# Altium project V3.PrjPcb (part 2 of 4)

## Sheet ETH_Switch.SchDoc
size A3
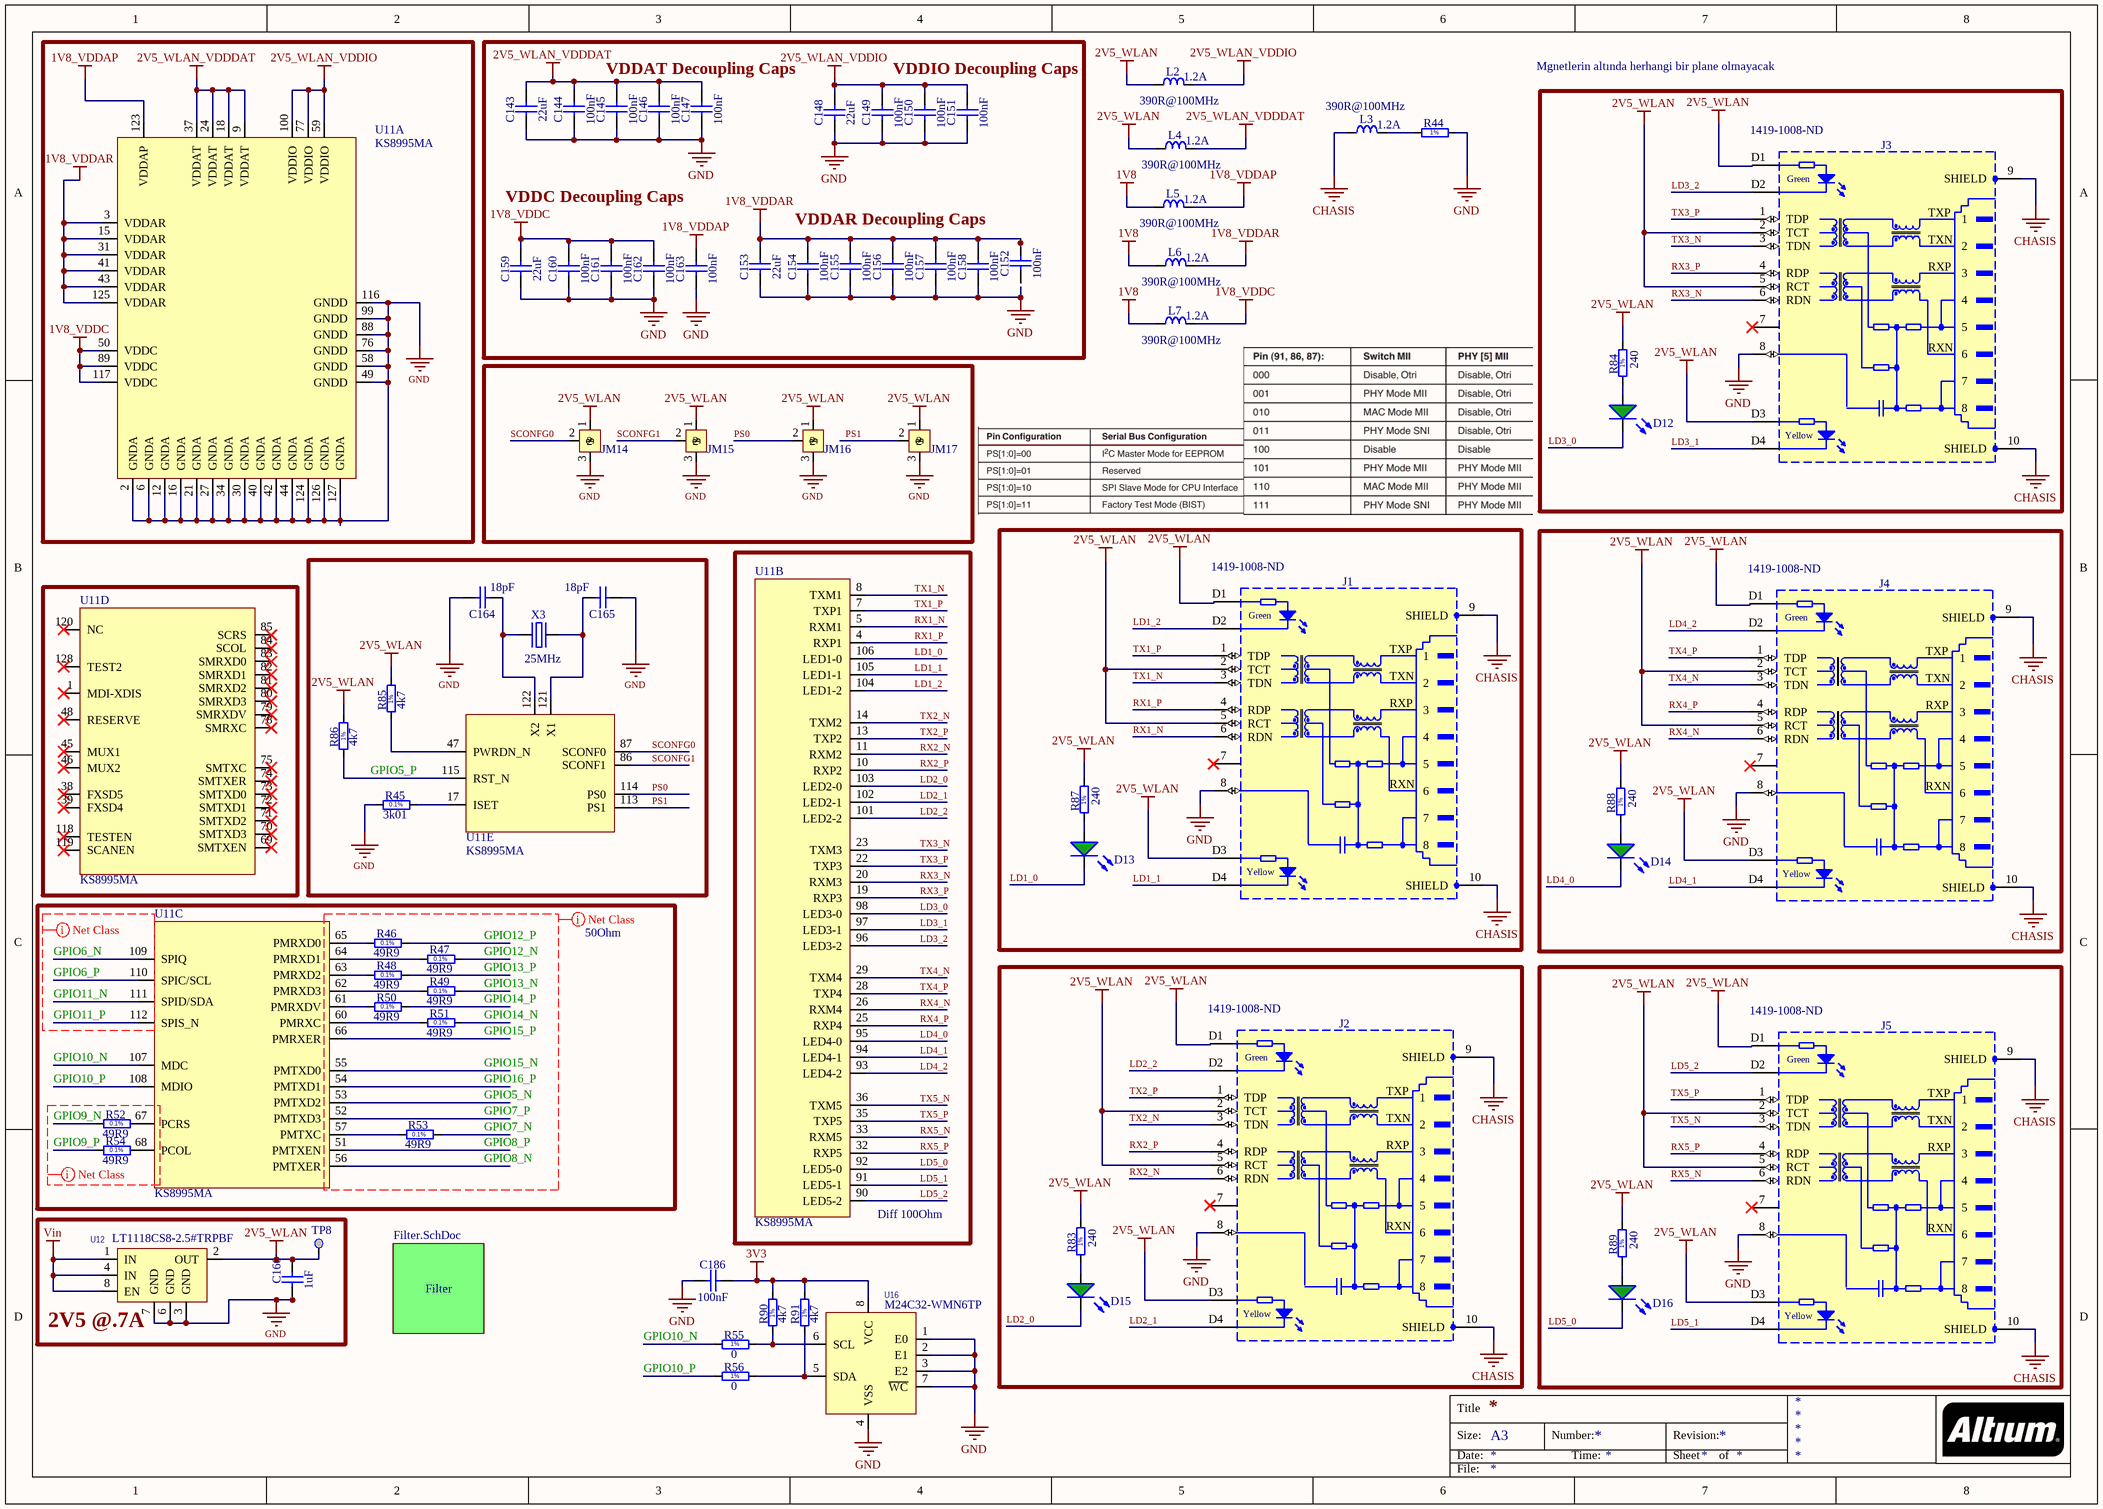
[diagram p3: ETH_Switch.SchDoc]

### Parts
C143  22uF  [CAPC2012X135N]
C144  100nF  [CAPC1608X87N]
C145  100nF  [CAPC1608X87N]
C146  100nF  [CAPC1608X87N]
C147  100nF  [CAPC1608X87N]
C148  22uF  [CAPC2012X135N]
C149  100nF  [CAPC1608X87N]
C150  100nF  [CAPC1608X87N]
C151  100nF  [CAPC1608X87N]
C152  100nF  [CAPC1608X87N]
C153  22uF  [CAPC2012X135N]
C154  100nF  [CAPC1608X87N]
C155  100nF  [CAPC1608X87N]
C156  100nF  [CAPC1608X87N]
C157  100nF  [CAPC1608X87N]
C158  100nF  [CAPC1608X87N]
C159  22uF  [CAPC2012X135N]
C160  100nF  [CAPC1608X87N]
C161  100nF  [CAPC1608X87N]
C162  100nF  [CAPC1608X87N]
C163  100nF  [CAPC1608X87N]
C164  18pF  [CAPC1608X87N]
C165  18pF  [CAPC1608X87N]
C166  1uF  [CAPC1608X87N]
C186  100nF  [CAPC1608X87N]
D12  LED0603  [LED0603]  (value not drawn)
D13  LED0603  [LED0603]  (value not drawn)
D14  LED0603  [LED0603]  (value not drawn)
D15  LED0603  [LED0603]  (value not drawn)
D16  LED0603  [LED0603]  (value not drawn)
J1  Supplier Part Number: 1419-1008-ND  [TYCO_5-6605308-1]  (hidden comment: RJ45)
J2  Supplier Part Number: 1419-1008-ND  [TYCO_5-6605308-1]  (hidden comment: RJ45)
J3  Supplier Part Number: 1419-1008-ND  [TYCO_5-6605308-1]  (hidden comment: RJ45)
J4  Supplier Part Number: 1419-1008-ND  [TYCO_5-6605308-1]  (hidden comment: RJ45)
J5  Supplier Part Number: 1419-1008-ND  [TYCO_5-6605308-1]  (hidden comment: RJ45)
JM14  Jumper 0R  [JUMPER_0R]  (value not drawn)
JM15  Jumper 0R  [JUMPER_0R]  (value not drawn)
JM16  Jumper 0R  [JUMPER_0R]  (value not drawn)
JM17  Jumper 0R  [JUMPER_0R]  (value not drawn)
L2  390R@100MHz  Power: 1.2A  [INDC1608X95N]
L3  390R@100MHz  Power: 1.2A  [INDC1608X95N]
L4  390R@100MHz  Power: 1.2A  [INDC1608X95N]
L5  390R@100MHz  Power: 1.2A  [INDC1608X95N]
L6  390R@100MHz  Power: 1.2A  [INDC1608X95N]
L7  390R@100MHz  Power: 1.2A  [INDC1608X95N]
R44  0  [RESC3216X65N]  (value not drawn)
R45  3k01  [RESC1608X55N]
R46  49R9  [RESC1608X55N]
R47  49R9  [RESC1608X55N]
R48  49R9  [RESC1608X55N]
R49  49R9  [RESC1608X55N]
R50  49R9  [RESC1608X55N]
R51  49R9  [RESC1608X55N]
R52  49R9  [RESC1608X55N]
R53  49R9  [RESC1608X55N]
R54  49R9  [RESC1608X55N]
R55  0  [RESC1608X55N]
R56  0  [RESC1608X55N]
R83  Resistance (Ohms): 240  [RESC1608X55N]
R84  Resistance (Ohms): 240  [RESC1608X55N]
R85  4k7  [RESC1608X55N]
R86  4k7  [RESC1608X55N]
R87  Resistance (Ohms): 240  [RESC1608X55N]
R88  Resistance (Ohms): 240  [RESC1608X55N]
R89  Resistance (Ohms): 240  [RESC1608X55N]
R90  4k7  [RESC1608X55N]
R91  4k7  [RESC1608X55N]
TP8  TP  [TP]  (value not drawn)  (no BOM)
U11  KS8995MA  [KS8995MA]  (parts A,B,C,D,E of 5)
U12  Manufacturer Part Number: LT1118CS8-2.5#TRPBF  [SO8]  (hidden comment: LT1118CS8-2.5)
U16  M24C32-WMN6TP  [SO8]
X3  25MHz  [XTAL1140X470X160N]

### Blocks framed on the sheet
Diff 100Ohm: U11
50Ohm: R46-R54 U11
2V5 @.7A: C166 TP8 U12

### Sub-sheets
Filter = Filter.SchDoc: no entries

### Nets
1V8: L5.1 L6.1 L7.1
1V8_VDDAP: C163.2 L5.2 U11.123(VDDAP)
1V8_VDDAR: C152.2 C153.2 C154.2 C155.2 C156.2 C157.2 C158.2 L6.2 U11.3(VDDAR) U11.15(VDDAR) U11.31(VDDAR) U11.41(VDDAR) U11.43(VDDAR) U11.125(VDDAR)
1V8_VDDC: C159.2 C160.2 C161.2 C162.2 L7.2 U11.50(VDDC) U11.89(VDDC) U11.117(VDDC)
2V5_WLAN: C166.2 J1.2(TCT) J1.5(RCT) J1.D1 J1.D3 J2.2(TCT) J2.5(RCT) J2.D1 J2.D3 J3.2(TCT) J3.5(RCT) J3.D1 J3.D3 J4.2(TCT) J4.5(RCT) J4.D1 J4.D3 J5.2(TCT) J5.5(RCT) J5.D1 J5.D3 JM14.1 JM15.1 JM16.1 JM17.1 L2.1 L4.1 R83.2 R84.2 R85.2 R86.2 R87.2 R88.2 R89.2 TP8.1 U12.2(OUT)
2V5_WLAN_VDDDAT: C143.2 C144.2 C145.2 C146.2 C147.2 L4.2 U11.9(VDDAT) U11.18(VDDAT) U11.24(VDDAT) U11.37(VDDAT)
2V5_WLAN_VDDIO: C148.2 C149.2 C150.2 C151.2 L2.2 U11.59(VDDIO) U11.77(VDDIO) U11.100(VDDIO)
3V3: C186.2 R90.2 R91.2 U16.8(VCC)
CHASIS: J1.9(SHIELD) J1.10(SHIELD) J2.9(SHIELD) J2.10(SHIELD) J3.9(SHIELD) J3.10(SHIELD) J4.9(SHIELD) J4.10(SHIELD) J5.9(SHIELD) J5.10(SHIELD) L3.1
GND: C143.1 C144.1 C145.1 C146.1 C147.1 C148.1 C149.1 C150.1 C151.1 C153.1 C154.1 C155.1 C156.1 C157.1 C158.1 C159.1 C160.1 C161.1 C162.1 C163.1 C164.2 C165.1 C166.1 C186.1 J1.8 J2.8 J3.8 J4.8 J5.8 JM14.3 JM15.3 JM16.3 JM17.3 R44.2 R45.1 U11.2(GNDA) U11.6(GNDA) U11.12(GNDA) U11.16(GNDA) U11.21(GNDA) U11.27(GNDA) U11.30(GNDA) U11.34(GNDA) U11.40(GNDA) U11.42(GNDA) U11.44(GNDA) U11.49(GNDD) U11.58(GNDD) U11.76(GNDD) U11.88(GNDD) U11.99(GNDD) U11.116(GNDD) U11.124(GNDA) U11.126(GNDA) U11.127(GNDA) U12.3(GND) U12.6(GND) U12.7(GND) U16.1(E0) U16.2(E1) U16.3(E2) U16.4(VSS) U16.7(~{WC})
Vin: U12.1(IN) U12.4(IN) U12.8(EN)
GPIO5_N: U11.53(PMTXD2)
GPIO5_P: R86.1 U11.115(RST_N)
GPIO6_N: U11.109(SPIQ)
GPIO6_P: U11.110(SPIC/SCL)
GPIO7_N: R53.2
GPIO7_P: U11.52(PMTXD3)
GPIO8_N: U11.56(PMTXER)
GPIO8_P: U11.51(PMTXEN)
GPIO9_N: R52.1
GPIO9_P: R54.1
GPIO10_N: R55.1 U11.107(MDC)
GPIO10_P: R56.1 U11.108(MDIO)
GPIO11_N: U11.111(SPID/SDA)
GPIO11_P: U11.112(SPIS_N)
GPIO12_N: R47.2
GPIO12_P: R46.2
GPIO13_N: R49.2
GPIO13_P: R48.2
GPIO14_N: R51.2
GPIO14_P: R50.2
GPIO15_N: U11.55(PMTXD0)
GPIO15_P: U11.66(PMRXER)
GPIO16_P: U11.54(PMTXD1)
LD1_0: D13.K U11.106(LED1-0)
LD1_1: J1.D4 U11.105(LED1-1)
LD1_2: J1.D2 U11.104(LED1-2)
LD2_0: D15.K U11.103(LED2-0)
LD2_1: J2.D4 U11.102(LED2-1)
LD2_2: J2.D2 U11.101(LED2-2)
LD3_0: D12.K U11.98(LED3-0)
LD3_1: J3.D4 U11.97(LED3-1)
LD3_2: J3.D2 U11.96(LED3-2)
LD4_0: D14.K U11.95(LED4-0)
LD4_1: J4.D4 U11.94(LED4-1)
LD4_2: J4.D2 U11.93(LED4-2)
LD5_0: D16.K U11.92(LED5-0)
LD5_1: J5.D4 U11.91(LED5-1)
LD5_2: J5.D2 U11.90(LED5-2)
PS0: JM16.2 U11.114(PS0)
PS1: JM17.2 U11.113(PS1)
RX1_N: J1.6(RDN) U11.5(RXM1)
RX1_P: J1.4(RDP) U11.4(RXP1)
RX2_N: J2.6(RDN) U11.11(RXM2)
RX2_P: J2.4(RDP) U11.10(RXP2)
RX3_N: J3.6(RDN) U11.20(RXM3)
RX3_P: J3.4(RDP) U11.19(RXP3)
RX4_N: J4.6(RDN) U11.26(RXM4)
RX4_P: J4.4(RDP) U11.25(RXP4)
RX5_N: J5.6(RDN) U11.33(RXM5)
RX5_P: J5.4(RDP) U11.32(RXP5)
SCONFG0: JM14.2 U11.87(SCONF0)
SCONFG1: JM15.2 U11.86(SCONF1)
TX1_N: J1.3(TDN) U11.8(TXM1)
TX1_P: J1.1(TDP) U11.7(TXP1)
TX2_N: J2.3(TDN) U11.14(TXM2)
TX2_P: J2.1(TDP) U11.13(TXP2)
TX3_N: J3.3(TDN) U11.23(TXM3)
TX3_P: J3.1(TDP) U11.22(TXP3)
TX4_N: J4.3(TDN) U11.29(TXM4)
TX4_P: J4.1(TDP) U11.28(TXP4)
TX5_N: J5.3(TDN) U11.36(TXM5)
TX5_P: J5.1(TDP) U11.35(TXP5)
NetC164_1: C164.1 U11.122(X2) X3.1(OSC1)
NetC165_2: C165.2 U11.121(X1) X3.2(OSC2)
NetD12_A: D12.A R84.1
NetD13_A: D13.A R87.1
NetD14_A: D14.A R88.1
NetD15_A: D15.A R83.1
NetD16_A: D16.A R89.1
NetL3_2: L3.2 R44.1
NetR45_2: R45.2 U11.17(ISET)
NetR46_1: R46.1 U11.65(PMRXD0)
NetR47_1: R47.1 U11.64(PMRXD1)
NetR48_1: R48.1 U11.63(PMRXD2)
NetR49_1: R49.1 U11.62(PMRXD3)
NetR50_1: R50.1 U11.61(PMRXDV)
NetR51_1: R51.1 U11.60(PMRXC)
NetR52_2: R52.2 U11.67(PCRS)
NetR53_1: R53.1 U11.57(PMTXC)
NetR54_2: R54.2 U11.68(PCOL)
NetR55_2: R55.2 R90.1 U16.6(SCL)
NetR56_2: R56.2 R91.1 U16.5(SDA)
NetR85_1: R85.1 U11.47(PWRDN_N)

Not connected (* = marked no-connect by the designer): C152 1; J1 7*; J2 7*; J3 7*; J4 7*; J5 7*; U11 1(MDI-XDIS)* 38(FXSD5)* 39(FXSD4)* 45(MUX1)* 46(MUX2)* 48(RESERVE)* 69(SMTXEN)* 70(SMTXD3)* 71(SMTXD2)* 72(SMTXD1)* 73(SMTXD0)* 74(SMTXER)* 75(SMTXC)* 78(SMRXC)* 79(SMRXDV)* 80(SMRXD3)* 81(SMRXD2)* 82(SMRXD1)* 83(SMRXD0)* 84(SCOL)* 85(SCRS)* 118(TESTEN)* 119(SCANEN)* 120(NC)* 128(TEST2)*; U12 5(NC)

### Layout directives
net class MII: GPIO5_N, GPIO7_N, GPIO7_P, GPIO8_N, GPIO8_P, GPIO9_N, GPIO9_P, GPIO12_N, GPIO12_P, GPIO13_N, GPIO13_P, GPIO14_N, GPIO14_P, GPIO15_N, GPIO15_P, GPIO16_P
net class ETH_SPI: GPIO6_N, GPIO6_P, GPIO11_N, GPIO11_P

### Notes on the sheet
- VDDAT Decoupling Caps
- VDDIO Decoupling Caps
- Mgnetlerin altında herhangi bir plane olmayacak
- VDDC Decoupling Caps
- VDDAR Decoupling Caps
- Title
- Size:
- Date:
- A3
- Number:
- Time:
- Revision:
- Sheet
- of
- File:
- (in symbol R0603_0R_JUMPER) 1%
- (in symbol R0603_3K01_0.1%_0.063W_10PPM) 0.1%
- (in symbol R0603_4K7_1%_0.1W_100PPM) 1%
- (in symbol R0603_49R9_0.1%_0.063W_10PPM) 0.1%
- (in symbol R0603_240R_1%_0.1W_100PPM) 1%
- (in symbol R1206_0R_JUMPER) 1%
- (in symbol TYCO_5-6605308-1) Green; TXP; TXN; RXP; RXN; Yellow

### Library data of the parts
C143 C148 C153 C159 = CC0805_22UF_16V_10%_X5R: Non-polarised capacitor; Part Description: SMD Multilayer Chip Ceramic Capacitor; Manufacturer: TDK Corporation; Manufacturer Part Number: C2012X5R1C226K125AC; Manufacturer1 Part Number: C2012X5R1C226KT; Voltage: 16V; TC: X5R; Tolerance: ±10%; Table: Capacitors SMD; Capacitance: 22µF; Part Number: CC0805_22UF_16V_10%_X5R; Component Kind: Standard; Component Type: Standard; Pin Count: 2; Value: 22uF; Status: Preferred; Case: 0805; Mounted: Yes; Socket: No; SMD: Yes; Manufacturer1 Example: TDK; Manufacturer1 ComponentHeight: 1.35mm; HelpURL: \\cern.ch\dfs\Applications\Altium\Datasheets\CC0805_X5R_TDK_C.pdf; Author: CERN DEM JLC; CreateDate: 25.10.2012; LatestRevisionDate: 25.10.2012; Height - Seated (Max): -; Category: Capacitors; Supplier Part Number: 445-6797-2-ND; Supplier: Digi-Key; Applications: General Purpose; Operating Temperature: -55°C ~ 85°C; Packaging: Tape & Reel (TR); Ratings: -; Voltage - Rated: 16V; Temperature Coefficient: X5R; Thickness (Max): 0.057" (1.45mm); Mounting Type: Surface Mount, MLCC; Size / Dimension: 0.079" L x 0.049" W (2.00mm x 1.25mm); RoHS: RoHS Compliant; Lead Spacing: -; Features: Low ESL; Lead Style: -; Package / Case: 0805 (2012 Metric)
C144-C147 C149-C152 C154-C158 C160-C163 C186 = CC0603_100NF_50V_10%_X7R: Non-polarised capacitor; Part Description: SMD Multilayer Chip Ceramic Capacitor; Manufacturer: MULTICOMP; Manufacturer Part Number: MCB0603R104KCT; Manufacturer1 Part Number: 223858615649; Voltage: 50V; TC: X7R; Tolerance: ±10%; Table: Capacitors SMD; Voltage Rating: 16; Capacitance Tolerance ±: ± 10%; Dielectric Characteristic: X7; Capacitance: 0.1; SVHC: No SVHC (17-Dec-2015); Capacitor Terminals: SMD; Ceramic Capacitor Case: 0603 [1608 Metric]; Product Range: MCB Series; Part Number: CC0603_100NF_50V_10%_X7R; Component Kind: Standard; Component Type: Standard; Pin Count: 2; Value: 100nF; Status: Preferred; Case: 0603; Mounted: Yes; Socket: No; SMD: Yes; Manufacturer1 Example: PHYCOMP; Manufacturer1 ComponentHeight: 0.87mm; HelpURL: \\cern.ch\dfs\Applications\Altium\Datasheets\CC0603_X7R_PHYCOMP.pdf; Author: CERN DEM JLC; CreateDate: 3.12.2007; LatestRevisionDate: 3.12.2007; Supplier: Farnell; Capacitance Tolerance: ± 10%; Supplier Part Number: 9406140; RoHS: YES; Packaging: Cut Tape; MSL: -; Operating Temperature Max: 125; Operating Temperature Range: -55°C to +125°C<!--FANDB--><div class="features-and-benefits-container"><div class="features-and-benefits-description"><span class="features-benefits-value">The MCB0603R104KCT is a multilayer Ceramic Capacitor with 0603 chip, for general digital circuit. Consists of a conducting material and electrodes. To manufacture a chip-type SMT and achieve miniaturization, high density and high efficiency, ceramic condensers are used. MLCC is made by X7; Operating Temperature Min: -55
C164 C165 = CC0603_18PF_50V_5%_NP0: Non-polarised capacitor; Part Description: SMD Multilayer Chip Ceramic Capacitor; Manufacturer: Yageo; Manufacturer Part Number: CC0603JRNPO9BN180; Manufacturer1 Part Number: 223886715189; Voltage: 50V; TC: NP0; Tolerance: ±5%; Table: Capacitors SMD; Temperature Coefficient: C0G, NP0; Part Number: CC0603_18PF_50V_5%_NP0; Component Kind: Standard; Component Type: Standard; Pin Count: 2; Value: 18pF; Status: Preferred; Case: 0603; Mounted: Yes; Socket: No; SMD: Yes; Manufacturer1 Example: PHYCOMP; Manufacturer1 ComponentHeight: 0.87mm; HelpURL: \\cern.ch\dfs\Applications\Altium\Datasheets\CC0603_NP0_PHYCOMP.pdf; Author: CERN DEM JLC; CreateDate: 3.12.2007; LatestRevisionDate: 3.12.2007; Packaging: Tape & Reel (TR); Ratings: -; RoHS: RoHS Compliant; Size / Dimension: 0.063" L x 0.031" W (1.60mm x 0.80mm); Category: Capacitors; Package / Case: 0603 (1608 Metric); Supplier: Digi-Key; Applications: General Purpose; Mounting Type: Surface Mount, MLCC; Height - Seated (Max): -; Operating Temperature: -55°C ~ 125°C; Voltage - Rated: 50V; Lead Style: -; Supplier Part Number: 311-1061-2-ND; Features: -; Lead Spacing: -; Capacitance: 18pF; Thickness (Max): 0.035" (0.90mm)
C166 = CC0603_1UF_25V_10%_X7R: Non-polarised capacitor; Part Description: SMD Multilayer Chip Ceramic Capacitor; Manufacturer: MULTICOMP; Manufacturer Part Number: MC0603F104Z250CT; Manufacturer1 Part Number: GRM188R71E105KA12D; Voltage: 25V; TC: X7R; Tolerance: ±10%; Table: Capacitors SMD; Capacitance: 0.1; Capacitance Tolerance: +80%, -20%; No. of Pins: 2; Product Range: MC Series; External Length / Height: 0.8; Dielectric Characteristic: Y5; Ceramic Capacitor Case: 0603 [1608 Metric]; Capacitor Terminals: SMD; External Depth: 1.6; SVHC: No SVHC (17-Dec-2015); Voltage Rating: 25; Part Number: CC0603_1UF_25V_10%_X7R; Component Kind: Standard; Component Type: Standard; Pin Count: 2; Value: 1uF; Status: None; Case: 0603; Mounted: Yes; Socket: No; SMD: Yes; Manufacturer1 Example: MURATA; Manufacturer1 ComponentHeight: 0.9mm; HelpURL: \\cern.ch\dfs\Applications\Altium\Datasheets\CC0603_X7R_MURATA.pdf; Author: CERN DEM JLC; CreateDate: 18.01.2011; LatestRevisionDate: 18.01.2011; MSL: -; Supplier Part Number: 1759038; Capacitance Tolerance ±: +80%, -20%; External Width: 0.8; Operating Temperature Range: -25°C to +85°C<!--FANDB--><div class="features-and-benefits-container"><div class="features-and-benefits-description"><span class="features-benefits-value">The MC0603F104Z250CT is a general purpose Multilayer Ceramic Capacitor with Cu/Ni/Sn-plated termination, Y5V dielectric and 0603 case. The multilayer ceramic capacitor consists of a conducting material and electrodes. To manufacture a chip-type SMT and achieve miniaturization, high density and high efficiency, ceramic condensers are used. High electrical precision, stability and reliability.</span></div><div class="features-and-benefits-list"><ul class="features-and-benefits-list-list"><li class="features-and-benefits-list-item">High capacitance</li></ul></div><div class="features-and-benefits-applications"><ul class="features-and-benefits-value"><li class="features-and-benefits-list-item">Power Management</li><li class="features-and-benefits-list-item">Consumer Electronics</li><li class="features-and-benefits-list-item">Communications & Networking</li></ul></div></div>; Supplier: Farnell; Packaging: Cut Tape; Operating Temperature Max: 85; Operating Temperature Min: -30; RoHS: YES
D12-D16 = LED0603: Diode, LED, 0603, Green; Manufacturer Part Number: 5988070100F; Manufacturer: Dialight; Current - Test: 20mA; Voltage - Forward (Vf) (Typ): 3.2V; Lens Transparency: Clear; Lens Style/Size: Rectangle with Flat Top, 1.10mm x 0.80mm; Lens Color: Colorless; Viewing Angle: 140°; Millicandela Rating: 20mcd; Wavelength - Dominant: 566nm; Category: Optoelectronics; Wavelength - Peak: -; Supplier: Digi-Key; Supplier Device Package: *; Height (Max): 0.70mm; Size / Dimension: 1.60mm L x 0.80mm W; Mounting Type: Surface Mount; RoHS: RoHS Compliant; Package / Case: 0603 (1608 Metric); Packaging: Cut Strip; Color: Green; Supplier Part Number: 5988070100F-ND; Features: -
J1-J5 = TYCO_5-6605308-1: 1 Port, Yellow/Green LEDs, RJ45 10/100Base-T Ethernet, Mag45 Connector Module With Integrated Magnetics; Manufacturer: TRP Connector B.V.; Table: TYCO; LED Color: Green - Yellow; Tab Direction: Down; Shield Material: Brass; Number of Cores per Jack: 4; Shielding: Shielded, EMI Finger; Number of Ports: 1; Part Number: TYCO_5-6605308-1; Component Kind: Standard; Component Type: Standard; Pin Count: 14; Family: RJ45; Mounted: Yes; Socket: No; SMD: No; Status: None; Part Description: 1 Port, Yellow/Green LEDs, RJ45 10/100Base-T Ethernet, Mag45 Connector Module With Integrated Magnetics; Manufacturer Part Number: 5-6605308-1; ComponentHeight: 15.24mm; HelpURL: \\cern.ch\dfs\Applications\Altium\Datasheets\TYCO_5-6605308-1.pdf; Author: CERN DEM JLC; CreateDate: 23.08.2012; LatestRevisionDate: 23.08.2012; Mounting Type: Through Hole; Features: Board Guide, Decoupling Capacitance; Height Above Board: 0.555" (14.10mm); Orientation: 90° Angle (Right); Category: Connectors, Interconnects; Number of Rows: 1; Termination: Solder; Connector Type: RJ45; Supplier: Digi-Key; Contact Material: Phosphor Bronze; Operating Temperature: 0°C ~ 70°C; Housing Material: Polyethylene Terephthalate (PET), Polyester; Applications: 10/100 Base-T, AutoMDIX; Contact Finish Thickness: 50µin (1.27µm); Contact Finish: Gold; RoHS: RoHS Compliant; Packaging: Tray
L2-L7 = IND0603_TDK_MPZ1608R391A: Inductor; Part Description: SMT Chip Bead for Power Line; Manufacturer: TDK Corporation; Manufacturer Part Number: MPZ1608R391ATD25; Resistance: 0.12R; Tolerance: ±25%; Table: Inductors SMD; Number of Lines: 1; Impedance @ Frequency: 390 Ohm @ 100MHz; DC Resistance (DCR) (Max): 120 mOhm; Filter Type: Power Line; Part Number: IND0603_TDK_MPZ1608R391A; Component Kind: Standard; Component Type: Standard; Pin Count: 2; Value: 390R@100MHz; Status: None; Case: 0603; Mounted: Yes; Socket: No; SMD: Yes; ComponentHeight: 0.95mm; HelpURL: \\cern.ch\dfs\Applications\Altium\Datasheets\IND0603_TDK_MPZ1608.pdf; Author: CERN DEM JLC; CreateDate: 02.12.2009; LatestRevisionDate: 02.12.2009; Current Rating (Max): 1.2A; Supplier: Digi-Key; Operating Temperature: -55°C ~ 125°C; Supplier Part Number: 445-172888-1-ND; Packaging: Cut Tape (CT); Category: Filters; Package / Case: 0603 (1608 Metric); RoHS: RoHS Compliant; Size / Dimension: 0.063" L x 0.031" W (1.60mm x 0.80mm); Mounting Type: Surface Mount; Height (Max): 0.037" (0.95mm); Ratings: AEC-Q200
R44 = R1206_0R_JUMPER: Resistor - 1%; Part Description: 2A (0.05R Max DC Resistance) Zero Ohm Jumper; Manufacturer: PANASONIC ELECTRONIC COMPONENTS; Manufacturer Part Number: ERJ8GEY0R00V; Manufacturer1 Part Number: NRC12Z0; Table: Resistors SMD; Product Range: AEC-Q200 ERJ8; Voltage Rating: 200; Temperature Coefficient: -100ppm/°C to +600; Resistor Mounting: Surface Mount Device<!--FANDB--><div class="features-and-benefits-container"><div class="features-and-benefits-description"><span class="features-benefits-value">The Panasonic ERJ 8G series resistors are automotive grade thick film chip resistors. The resistance range includes E24 decade values from 1ohm to 10Mohm. ERJ series resistors have metal glaze thick film resistive element and three layers of electrodes that make them highly reliable.</span></div><div class="features-and-benefits-list"><ul class="features-and-benefits-list-list"><li class="features-and-benefits-list-item">EIA 01005, 0201, 0402, 0603, 0805, 1206, 1210, 1812, 2010, 2512 case sizes available</li><li class="features-and-benefits-list-item">Small size, low weight resistors</li><li class="features-and-benefits-list-item">Automotive grade AEC-Q200 compliant</li><li class="features-and-benefits-list-item">Maximum power rating of 1W</li><li class="features-and-benefits-list-item">Tolerance of ±5%</li><li class="features-and-benefits-list-item">Temperature coefficient (TCR) of -100 to +600, -400 to +150, ±300 and ±200ppm/°C</li><li class="features-and-benefits-list-item">Available in -55°C to 125°C and -55°C to 155°C operating temperature ranges</li><li class="features-and-benefits-list-item">Meets IEC 60115-8, JIS C 5201-8, EIAJ RC-2134; Resistor Case Style: 1206 [3216 Metric]; SVHC: No SVHC (15-Jun-2015); Resistor Element Material: Thick Film; Power Rating: 250; Part Number: R1206_0R_JUMPER; Component Kind: Standard; Component Type: Standard; Pin Count: 2; Value: 0; Status: Preferred; Case: 1206; Mounted: Yes; Socket: No; SMD: Yes; Manufacturer1 Example: NIC COMPONENT; Manufacturer1 ComponentHeight: 0.65mm; HelpURL: \\cern.ch\dfs\Applications\Altium\Datasheets\R1206_NIC_NRC.pdf; Author: CERN DEM JLC; CreateDate: 3.12.2007; LatestRevisionDate: 13.03.2008; Packaging: Cut Tape; Supplier Part Number: 2057791; Supplier: Farnell; Resistance: 0; Resistance Tolerance: -; MSL: -; RoHS: YES
R45 = R0603_3K01_0.1%_0.063W_10PPM: Resistor - 0.1%; Part Description: Thin Film Chip Resistor; Manufacturer: Yageo; Manufacturer Part Number: RC0603FR-073K01L; Manufacturer1 Part Number: RN73C1J3K01BTDF; Power: 0.063W; TC: ±10ppm; Tolerance: ±1%; Table: Resistors SMD; Temperature Coefficient: ±100ppm/°C; Resistance (Ohms): 3.01k; Power (Watts): 0.1W, 1/10W; Part Number: R0603_3K01_0.1%_0.063W_10PPM; Component Kind: Standard; Component Type: Standard; Pin Count: 2; Value: 3k01; Status: Not recommended; Case: 0603; Mounted: Yes; Socket: No; SMD: Yes; Manufacturer1 Example: TYCO HOLSWORTHY; Manufacturer1 ComponentHeight: 0.5mm; HelpURL: \\cern.ch\dfs\Applications\Altium\Datasheets\R0603_Tyco_RN73.pdf; Author: CERN DEM JLC; CreateDate: 3.12.2007; LatestRevisionDate: 13.03.2008; Package / Case: 0603 (1608 Metric); Size / Dimension: 0.063" L x 0.031" W (1.60mm x 0.80mm); Height: 0.022" (0.55mm); Number of Terminations: 2; Packaging: Cut Tape (CT); Supplier Part Number: 311-3.01KHRCT-ND; Supplier: Digi-Key; Operating Temperature: -55°C ~ 155°C; RoHS: RoHS Compliant; Supplier Device Package: 0603; Composition: Thick Film; Features: Moisture Resistant; Category: Resistors
R46-R54 = R0603_49R9_0.1%_0.063W_10PPM: Resistor - 0.1%; Part Description: Thin Film Chip Resistor; Manufacturer: Panasonic Electronic Components; Manufacturer Part Number: ERJ-3EKF49R9V; Manufacturer1 Part Number: RN73C1J49R9BTDF; Power: 0.063W; TC: ±10ppm; Tolerance: ±1%; Table: Resistors SMD; Resistance (Ohms): 49.9; Temperature Coefficient: ±100ppm/°C; Power (Watts): 0.1W, 1/10W; Part Number: R0603_49R9_0.1%_0.063W_10PPM; Component Kind: Standard; Component Type: Standard; Pin Count: 2; Value: 49R9; Status: Not recommended; Case: 0603; Mounted: Yes; Socket: No; SMD: Yes; Manufacturer1 Example: TYCO HOLSWORTHY; Manufacturer1 ComponentHeight: 0.5mm; HelpURL: \\cern.ch\dfs\Applications\Altium\Datasheets\R0603_Tyco_RN73.pdf; Author: CERN DEM JLC; CreateDate: 03.12.2007; LatestRevisionDate: 13.03.2008; Supplier Device Package: 0603; Height: 0.022" (0.55mm); Packaging: Digi-Reel®; Operating Temperature: -55°C ~ 155°C; Category: Resistors; Supplier Part Number: P49.9HDKR-ND; Size / Dimension: 0.063" L x 0.031" W (1.60mm x 0.80mm); Package / Case: 0603 (1608 Metric); Supplier: Digi-Key; RoHS: RoHS Compliant; Composition: Thick Film; Number of Terminations: 2; Features: Automotive AEC-Q200
R55 R56 = R0603_0R_JUMPER: Resistor - 1%; Part Description: 1A (0.05R Max DC Resistance) Zero Ohm Jumper; Manufacturer: MULTICOMP; Manufacturer Part Number: MC0603SAF0000T5E; Manufacturer1 Part Number: NRC06Z0; Table: Resistors SMD; Part Number: R0603_0R_JUMPER; Component Kind: Standard; Component Type: Standard; Pin Count: 2; Value: 0; Status: Preferred; Case: 0603; Mounted: Yes; Socket: No; SMD: Yes; Manufacturer1 Example: NIC COMPONENT; Manufacturer1 ComponentHeight: 0.55mm; HelpURL: \\cern.ch\dfs\Applications\Altium\Datasheets\R0603_NIC_NRC.pdf; Author: CERN DEM JLC; CreateDate: 03.12.2007; LatestRevisionDate: 13.03.2008; Supplier Part Number: 2309111; Supplier: Farnell; RoHS: YES
R83 R84 R87-R89 = R0603_240R_1%_0.1W_100PPM: Resistor - 1%; Manufacturer: Yageo; Manufacturer Part Number: RC0603JR-07240RL; Temperature Coefficient: ±100ppm/°C; Description: RES SMD 240 OHM 5% 1/10W 0603; Tolerance: ±5%; Power (Watts): 0.1W, 1/10W; Author: CERN DEM JLC; Supplier Device Package: 0603; RoHS: RoHS Compliant; Category: Resistors; Supplier Part Number: 311-240GRCT-ND; Features: Moisture Resistant; Number of Terminations: 2; Height: 0.022" (0.55mm); Composition: Thick Film; Size / Dimension: 0.063" L x 0.031" W (1.60mm x 0.80mm); Package / Case: 0603 (1608 Metric); Packaging: Cut Tape (CT); Operating Temperature: -55°C ~ 155°C; Supplier: Digi-Key
R85 R86 R90 R91 = R0603_4K7_1%_0.1W_100PPM: Resistor - 1%; Part Description: General Purpose Thick Film Chip Resistor; Manufacturer: Yageo; Manufacturer Part Number: RC0603JR-074K7L; Manufacturer1 Part Number: NRC06F4701TRF; Power: 0.1W; TC: ±100ppm/°C; Tolerance: ±5%; Table: Resistors SMD; Resistance (Ohms): 4.7k; Power (Watts): 0.1W, 1/10W; Part Number: R0603_4K7_1%_0.1W_100PPM; Component Kind: Standard; Component Type: Standard; Pin Count: 2; Value: 4k7; Status: Preferred; Case: 0603; Mounted: Yes; Socket: No; SMD: Yes; Manufacturer1 Example: NIC COMPONENT; Manufacturer1 ComponentHeight: 0.55mm; HelpURL: \\cern.ch\dfs\Applications\Altium\Datasheets\R0603_NIC_NRC.pdf; Author: CERN DEM JLC; CreateDate: 3.12.2007; LatestRevisionDate: 13.03.2008; Size / Dimension: 0.063" L x 0.031" W (1.60mm x 0.80mm); Supplier Device Package: 0603; Supplier: Digi-Key; Features: Moisture Resistant; Package / Case: 0603 (1608 Metric); Category: Resistors; Temperature Coefficient: ±100ppm/°C; Number of Terminations: 2; Packaging: Cut Tape (CT); Height: 0.022" (0.55mm); Composition: Thick Film; RoHS: RoHS Compliant; Operating Temperature: -55°C ~ 155°C; Supplier Part Number: 311-4.7KGRCT-ND
TP8 = Test Point
U11 = KS8995MA: IC SWITCH 10/100 5PORT 128PQFP; Manufacturer: Microchip Technology; RoHS: RoHS Compliant; Mounting Type: Surface Mount; Supplier: Digi-Key; Packaging: Bulk; Category: Integrated Circuits (ICs); Package / Case: 128-BFQFP; Manufacturer Part Number: KS8995MA; Type: 10/100 Integrated Switch; Supplier Device Package: 128-PQFP (14x20); Applications: Port Switch/Network Interface; Supplier Part Number: KS8995MA-ND
U12 = LT1118CS8-2.5: IC REG LDO 2.5V 0.8A 8SOIC; Manufacturer: Linear Technology; Current - Output: 800mA; Voltage - Input: Up to 15V; Voltage - Dropout (Typical): 1V @ 800mA; Number of Regulators: 1; Regulator Topology: Positive Fixed; Package / Case: 8-SOIC (0.154", 3.90mm Width); Packaging: Tape & Reel (TR); RoHS: RoHS Compliant; Category: Integrated Circuits (ICs); Operating Temperature: 0°C ~ 70°C; Current - Limit (Min): -; Supplier: Digi-Key; Mounting Type: Surface Mount; Voltage - Output: 2.5V; Supplier Device Package: 8-SOIC; Supplier Part Number: LT1118CS8-2.5#TRPBF-ND
U16 = M24C32-WMN6TP: IC EEPROM 32KBIT 400KHZ 8SO; Manufacturer: STMicroelectronics; Interface: I²C, 2-Wire Serial; Memory Size: 32K (4K x 8); Voltage - Supply: 2.5 V ~ 5.5 V; Format - Memory: EEPROMs - Serial; Speed: 400kHz; Supplier Device Package: 8-SO; Supplier: Digi-Key; Packaging: Digi-Reel®; RoHS: RoHS Compliant; Package / Case: 8-SOIC (0.154", 3.90mm Width); Operating Temperature: -40°C ~ 85°C; Memory Type: EEPROM; Category: Integrated Circuits (ICs); Supplier Part Number: 497-5027-6-ND; Manufacturer Part Number: M24C32-WMN6TP
X3 = XTAL_25MHZ_ABRACON_ABLS-25.000MHZ-B2F-T: Quartz Crystal; Part Description: ±20ppm Low Profile Surface Mount Microprocessor Crystal, HC49 US ABLS Serie; Manufacturer: Abracon LLC; Table: Crystals & Oscillators; Frequency Tolerance: ±20ppm; Operating Mode: Fundamental; Load Capacitance: 18pF; ESR (Equivalent Series Resistance): 40 Ohm; Frequency Stability: ±50ppm; Part Number: XTAL_25MHZ_ABRACON_ABLS-25.000MHZ-B2F-T; Component Kind: Standard; Component Type: Standard; PackageDescription: HC49US Crystal;11.40mm L X 4.70mm W X 1.60mm H; Value: 25MHz; Manufacturer Part Number: ABLS-25.000MHZ-B2F-T; Pin Count: 2; Mounted: Yes; Socket: No; SMD: Yes; ComponentHeight: 1.6mm; HelpURL: \\cern.ch\dfs\Applications\Altium\Datasheets\XTAL_ABRACON_ABLS.pdf; Author: CERN DEM JLC; CreateDate: 3.06.2010; LatestRevisionDate: 9.01.2012; Mounting Type: Surface Mount; Height: 0.165" (4.20mm); Supplier: Digi-Key; Packaging: Tape & Reel (TR); RoHS: RoHS Compliant; Ratings: -; Category: Crystals and Oscillators; Type: MHz Crystal; Supplier Part Number: 535-9078-2-ND; Operating Temperature: -20°C ~ 70°C; Size / Dimension: 0.449" L x 0.185" W (11.40mm x 4.70mm); Package / Case: HC49/US; Frequency: 25MHz

## Sheet Filter.SchDoc: Title
size A3; CheckedBy: -; CompanyName: CERN; DrawnBy: DrawnBy; Organization: CERN; Address1: European Organization for Nuclear Research; Address2: CH-1211 Genève 23 - Switzerland; Revision: -; SheetNumber: -; SheetTotal: -; EDA_Number: EDA-XXXXX-VX-X; Projet: -; ModifiedBy: -; CreateDate: XX/XX/XXXX; CheckedDate: -; Title2: Title2; DivGrp: TE/MPE; Designer: Designer; ModifiedDate: -
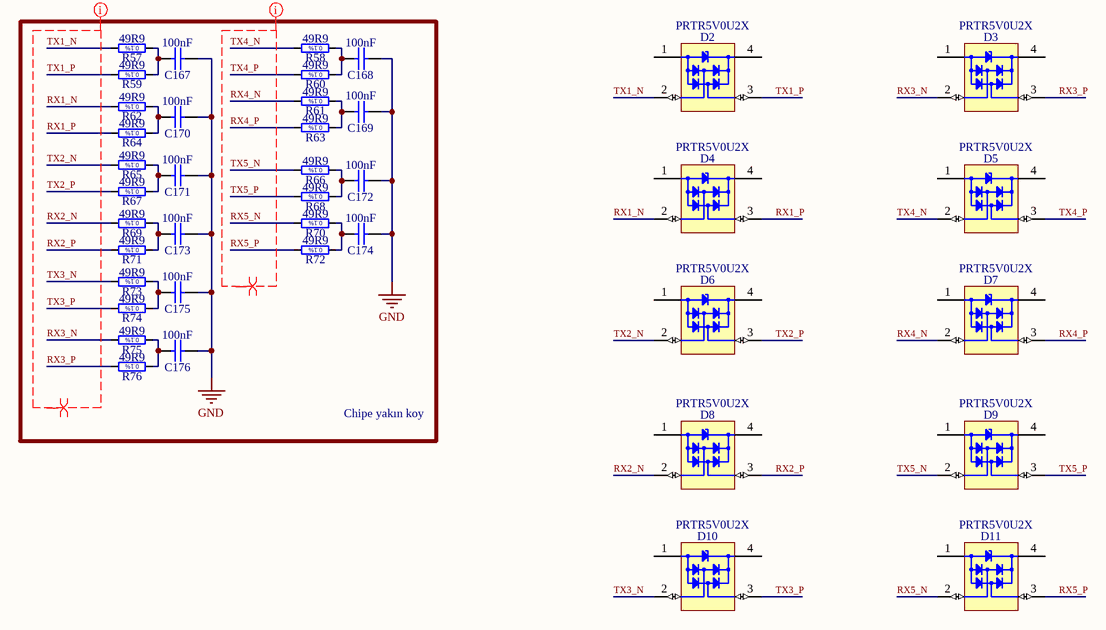
[diagram p4: Filter.SchDoc]

### Parts
C167  100nF  [CAPC1608X87N]
C168  100nF  [CAPC1608X87N]
C169  100nF  [CAPC1608X87N]
C170  100nF  [CAPC1608X87N]
C171  100nF  [CAPC1608X87N]
C172  100nF  [CAPC1608X87N]
C173  100nF  [CAPC1608X87N]
C174  100nF  [CAPC1608X87N]
C175  100nF  [CAPC1608X87N]
C176  100nF  [CAPC1608X87N]
D2  PRTR5V0U2X  [SOT190P230X110-4N]
D3  PRTR5V0U2X  [SOT190P230X110-4N]
D4  PRTR5V0U2X  [SOT190P230X110-4N]
D5  PRTR5V0U2X  [SOT190P230X110-4N]
D6  PRTR5V0U2X  [SOT190P230X110-4N]
D7  PRTR5V0U2X  [SOT190P230X110-4N]
D8  PRTR5V0U2X  [SOT190P230X110-4N]
D9  PRTR5V0U2X  [SOT190P230X110-4N]
D10  PRTR5V0U2X  [SOT190P230X110-4N]
D11  PRTR5V0U2X  [SOT190P230X110-4N]
R57  49R9  [RESC1608X55N]
R58  49R9  [RESC1608X55N]
R59  49R9  [RESC1608X55N]
R60  49R9  [RESC1608X55N]
R61  49R9  [RESC1608X55N]
R62  49R9  [RESC1608X55N]
R63  49R9  [RESC1608X55N]
R64  49R9  [RESC1608X55N]
R65  49R9  [RESC1608X55N]
R66  49R9  [RESC1608X55N]
R67  49R9  [RESC1608X55N]
R68  49R9  [RESC1608X55N]
R69  49R9  [RESC1608X55N]
R70  49R9  [RESC1608X55N]
R71  49R9  [RESC1608X55N]
R72  49R9  [RESC1608X55N]
R73  49R9  [RESC1608X55N]
R74  49R9  [RESC1608X55N]
R75  49R9  [RESC1608X55N]
R76  49R9  [RESC1608X55N]

### Blocks framed on the sheet
Chipe yakın koy: C167-C176 R57-R76

### Nets
GND: C167.1 C168.1 C169.1 C170.1 C171.1 C172.1 C173.1 C174.1 C175.1 C176.1
RX1_N: D4.2(I/O1) R62.2
RX1_P: D4.3(I/O2) R64.2
RX2_N: D8.2(I/O1) R69.2
RX2_P: D8.3(I/O2) R71.2
RX3_N: D3.2(I/O1) R75.2
RX3_P: D3.3(I/O2) R76.2
RX4_N: D7.2(I/O1) R61.2
RX4_P: D7.3(I/O2) R63.2
RX5_N: D11.2(I/O1) R70.2
RX5_P: D11.3(I/O2) R72.2
TX1_N: D2.2(I/O1) R57.2
TX1_P: D2.3(I/O2) R59.2
TX2_N: D6.2(I/O1) R65.2
TX2_P: D6.3(I/O2) R67.2
TX3_N: D10.2(I/O1) R73.2
TX3_P: D10.3(I/O2) R74.2
TX4_N: D5.2(I/O1) R58.2
TX4_P: D5.3(I/O2) R60.2
TX5_N: D9.2(I/O1) R66.2
TX5_P: D9.3(I/O2) R68.2
NetC167_2: C167.2 R57.1 R59.1
NetC168_2: C168.2 R58.1 R60.1
NetC169_2: C169.2 R61.1 R63.1
NetC170_2: C170.2 R62.1 R64.1
NetC171_2: C171.2 R65.1 R67.1
NetC172_2: C172.2 R66.1 R68.1
NetC173_2: C173.2 R69.1 R71.1
NetC174_2: C174.2 R70.1 R72.1
NetC175_2: C175.2 R73.1 R74.1
NetC176_2: C176.2 R75.1 R76.1

Not connected (* = marked no-connect by the designer): D2 1(GND) 4(VCC); D3 1(GND) 4(VCC); D4 1(GND) 4(VCC); D5 1(GND) 4(VCC); D6 1(GND) 4(VCC); D7 1(GND) 4(VCC); D8 1(GND) 4(VCC); D9 1(GND) 4(VCC); D10 1(GND) 4(VCC); D11 1(GND) 4(VCC)

### Layout directives
differential pair: RX1_N, RX1_P, RX2_N, RX2_P, RX3_N, RX3_P, RX4_N, RX4_P, RX5_N, RX5_P, TX1_N, TX1_P, TX2_N, TX2_P, TX3_N, TX3_P, TX4_N, TX4_P, TX5_N, TX5_P
net class Ethernet: RX1_N, RX1_P, RX2_N, RX2_P, RX3_N, RX3_P, RX4_N, RX4_P, RX5_N, RX5_P, TX1_N, TX1_P, TX2_N, TX2_P, TX3_N, TX3_P, TX4_N, TX4_P, TX5_N, TX5_P

### Notes on the sheet
- Title
- Size:
- Date:
- A3
- Number:
- Time:
- Revision:
- Sheet
- of
- File:
- (in symbol R0603_49R9_0.1%_0.063W_10PPM) 0.1%

### Library data of the parts
C167-C176 = CC0603_100NF_50V_10%_X7R: Non-polarised capacitor; Part Description: SMD Multilayer Chip Ceramic Capacitor; Manufacturer: MULTICOMP; Manufacturer Part Number: MCB0603R104KCT; Manufacturer1 Part Number: 223858615649; Voltage: 50V; TC: X7R; Tolerance: ±10%; Table: Capacitors SMD; Voltage Rating: 16; Capacitance Tolerance ±: ± 10%; Dielectric Characteristic: X7; Capacitance: 0.1; Description: MULTICOMP - MCB0603R104KCT - CAP, MLCC, X7R, 100NF, 16V, 0603; SVHC: No SVHC (17-Dec-2015); Capacitor Terminals: SMD; Ceramic Capacitor Case: 0603 [1608 Metric]; Product Range: MCB Series; Part Number: CC0603_100NF_50V_10%_X7R; Component Kind: Standard; Component Type: Standard; Pin Count: 2; Value: 100nF; Status: Preferred; Case: 0603; Mounted: Yes; Socket: No; SMD: Yes; Manufacturer1 Example: PHYCOMP; Manufacturer1 ComponentHeight: 0.87mm; HelpURL: \\cern.ch\dfs\Applications\Altium\Datasheets\CC0603_X7R_PHYCOMP.pdf; Author: CERN DEM JLC; CreateDate: 03.12.2007; LatestRevisionDate: 03.12.2007; Supplier: Farnell; Capacitance Tolerance: ± 10%; Supplier Part Number: 9406140; RoHS: YES; Packaging: Cut Tape; MSL: -; Operating Temperature Max: 125; Operating Temperature Range: -55°C to +125°C<!--FANDB--><div class="features-and-benefits-container"><div class="features-and-benefits-description"><span class="features-benefits-value">The MCB0603R104KCT is a multilayer Ceramic Capacitor with 0603 chip, for general digital circuit. Consists of a conducting material and electrodes. To manufacture a chip-type SMT and achieve miniaturization, high density and high efficiency, ceramic condensers are used. MLCC is made by X7; Operating Temperature Min: -55
D2-D11 = PRTR5V0U2X: Ultra Low Capacitance Double Rail-to-Rail ESD Protection Diode; Part Description: Ultra Low Capacitance (1pF) Double Rail-to-Rail ESD Protection Diode (8kV); Manufacturer: NXP Semiconductors; Manufacturer Part Number: PRTR5V0U2X,215; Voltage: 5.5V; Table: Diodes; Voltage - Reverse Standoff (Typ): 5.5V (Max); Capacitance @ Frequency: 1pF @ 1MHz; Type: Steering (Rail to Rail); Power Line Protection: Yes; Voltage - Breakdown (Min): 6V; Bidirectional Channels: 2; Part Number: PRTR5V0U2X; Component Kind: Standard; Component Type: Standard; Device: PRTR5V0U2X; PackageDescription: SOT143B, SOT, 1.90mm Pitch; 4 Pin, 1.30mm W X 2.90mm L X 1.10mm H body, IPC Medium Density; Pin Count: 4; Case: SOT143B; Mounted: Yes; Socket: No; SMD: Yes; ComponentHeight: 1.1mm; HelpURL: \\cern.ch\dfs\Applications\Altium\Datasheets\PRTR5V0U2X.pdf; Author: CERN DEM JLC; CreateDate: 22.03.2011; LatestRevisionDate: 22.03.2011; Applications: General Purpose; Packaging: Cut Tape (CT); Voltage - Clamping (Max) @ Ipp: -; Operating Temperature: -40°C ~ 85°C (TA); Category: Circuit Protection; Package / Case: TO-253-4, TO-253AA; Supplier: Digi-Key; Supplier Device Package: SOT-143B; Mounting Type: Surface Mount; Power - Peak Pulse: -; Unidirectional Channels: -; RoHS: RoHS Compliant; Supplier Part Number: 568-4140-1-ND; Current - Peak Pulse (10/1000µs): -
R57-R76 = R0603_49R9_0.1%_0.063W_10PPM: Resistor - 0.1%; Part Description: Thin Film Chip Resistor; Manufacturer: Panasonic Electronic Components; Manufacturer Part Number: ERJ-3EKF49R9V; Manufacturer1 Part Number: RN73C1J49R9BTDF; Power: 0.063W; TC: ±10ppm; Tolerance: ±1%; Table: Resistors SMD; Description: RES SMD 49.9 OHM 1% 1/10W 0603; Resistance (Ohms): 49.9; Temperature Coefficient: ±100ppm/°C; Power (Watts): 0.1W, 1/10W; Part Number: R0603_49R9_0.1%_0.063W_10PPM; Component Kind: Standard; Component Type: Standard; Pin Count: 2; Value: 49R9; Status: Not recommended; Case: 0603; Mounted: Yes; Socket: No; SMD: Yes; Manufacturer1 Example: TYCO HOLSWORTHY; Manufacturer1 ComponentHeight: 0.5mm; HelpURL: \\cern.ch\dfs\Applications\Altium\Datasheets\R0603_Tyco_RN73.pdf; Author: CERN DEM JLC; CreateDate: 03.12.2007; LatestRevisionDate: 13.03.2008; Supplier Device Package: 0603; Height: 0.022" (0.55mm); Packaging: Digi-Reel®; Operating Temperature: -55°C ~ 155°C; Category: Resistors; Supplier Part Number: P49.9HDKR-ND; Size / Dimension: 0.063" L x 0.031" W (1.60mm x 0.80mm); Package / Case: 0603 (1608 Metric); Supplier: Digi-Key; RoHS: RoHS Compliant; Composition: Thick Film; Number of Terminations: 2; Features: Automotive AEC-Q200

## Sheet Power.SchDoc: Title
size A3; CheckedBy: -; CompanyName: CERN; DrawnBy: DrawnBy; Organization: STM; Address1: European Organization for Nuclear Research; Address2: CH-1211 Genève 23 - Switzerland; Revision: -; SheetNumber: -; SheetTotal: -; EDA_Number: EDA-XXXXX-VX-X; Projet: -; ModifiedBy: -; CreateDate: XX/XX/XXXX; CheckedDate: -; Title2: Title2; DivGrp: TE/MPE; Designer: Designer; ModifiedDate: -
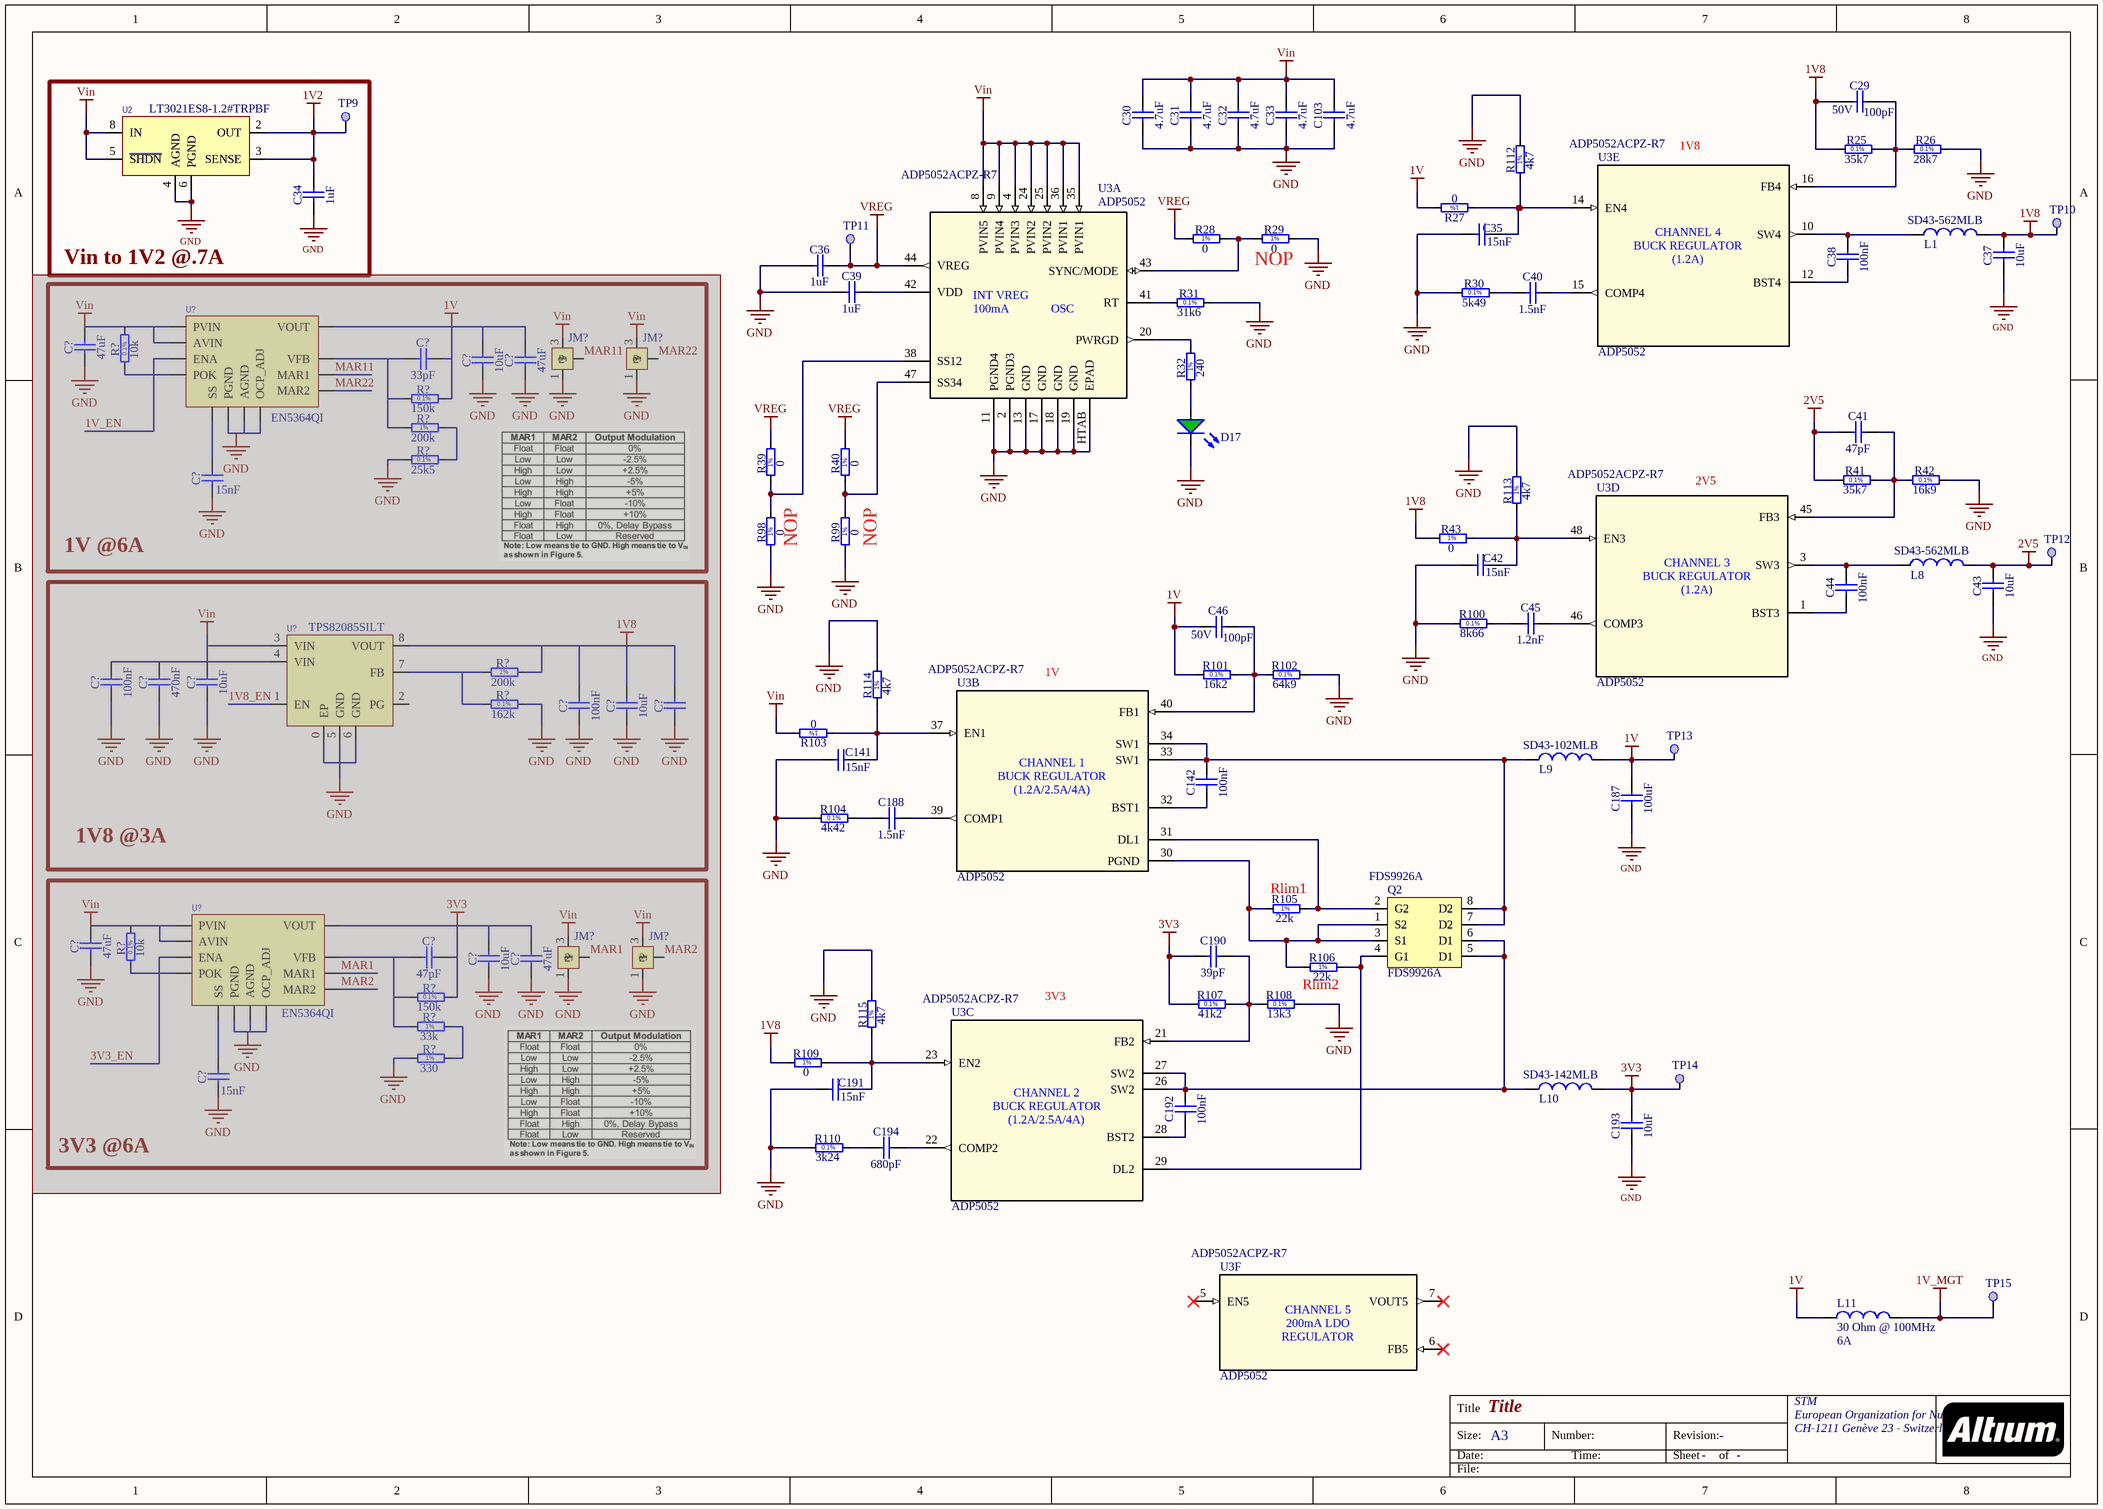
[diagram p5: Power.SchDoc]

### Parts
(Parts that share a designator on the sheet are numbered #1, #2 ... from top to bottom, then left to right.)
C29  100pF  Voltage: 50V  [CAPC1608X87N]
C30  4.7uF  [CAPC2012X135N]
C31  4.7uF  [CAPC2012X135N]
C32  4.7uF  [CAPC2012X135N]
C33  4.7uF  [CAPC2012X135N]
C34  1uF  [CAPC1608X87N]
C35  15nF  [CAPC1608X87N]
C36  1uF  [CAPC1608X87N]
C37  10uF  [CAPC3216X140N]
C38  100nF  [CAPC1608X87N]
C39  1uF  [CAPC1608X87N]
C40  1.5nF  [CAPC1608X87N]
C41  47pF  [CAPC1608X87N]
C42  15nF  [CAPC1608X87N]
C43  10uF  [CAPC3216X140N]
C44  100nF  [CAPC1608X87N]
C45  1.2nF  [CAPC1608X85N]
C46  100pF  Voltage: 50V  [CAPC1608X87N]
C103  4.7uF  [CAPC2012X135N]
C141  15nF  [CAPC1608X87N]
C142  100nF  [CAPC1608X87N]
C187  100uF  [CAPC3225X270N]
C188  1.5nF  [CAPC1608X87N]
C190  39pF  [CAPC1608X87N]
C191  15nF  [CAPC1608X87N]
C192  100nF  [CAPC1608X87N]
C193  10uF  [CAPC3216X140N]
C194  680pF  [CAPC1608X87N]
C?#1  33pF  [CAPC1608X87N]  (masked out: inside a compile mask, not in the netlist)
C?#2  47uF  [CAPC3225X270N]  (masked out: inside a compile mask, not in the netlist)
C?#3  10uF  [CAPC2012X135N]  (masked out: inside a compile mask, not in the netlist)
C?#4  47uF  [CAPC3225X270N]  (masked out: inside a compile mask, not in the netlist)
C?#5  15nF  [CAPC1608X87N]  (masked out: inside a compile mask, not in the netlist)
C?#6  100nF  [CAPC1608X87N]  (masked out: inside a compile mask, not in the netlist)
C?#7  470nF  [CAPC1608X87N]  (masked out: inside a compile mask, not in the netlist)
C?#8  10uF  [CAPC2012X135N]  (masked out: inside a compile mask, not in the netlist)
C?#9  100nF  [CAPC1608X87N]  (masked out: inside a compile mask, not in the netlist)
C?#10  10uF  [CAPC1608X87N]  (masked out: inside a compile mask, not in the netlist)
C?#11  22uF  [CAPC2012X135N]  (value not drawn)  (masked out: inside a compile mask, not in the netlist)
C?#12  47pF  [CAPC1608X87N]  (masked out: inside a compile mask, not in the netlist)
C?#13  47uF  [CAPC3225X270N]  (masked out: inside a compile mask, not in the netlist)
C?#14  10uF  [CAPC2012X135N]  (masked out: inside a compile mask, not in the netlist)
C?#15  47uF  [CAPC3225X270N]  (masked out: inside a compile mask, not in the netlist)
C?#16  15nF  [CAPC1608X87N]  (masked out: inside a compile mask, not in the netlist)
D17  LED0603  [LED0603]  (value not drawn)
JM?#1  Jumper 0R  [JUMPER_0R]  (value not drawn)  (masked out: inside a compile mask, not in the netlist)
JM?#2  Jumper 0R  [JUMPER_0R]  (value not drawn)  (masked out: inside a compile mask, not in the netlist)
JM?#3  Jumper 0R  [JUMPER_0R]  (value not drawn)  (masked out: inside a compile mask, not in the netlist)
JM?#4  Jumper 0R  [JUMPER_0R]  (value not drawn)  (masked out: inside a compile mask, not in the netlist)
L1  Manufacturer Part Number: SD43-562MLB  [sd43]  (hidden comment: SD43)
L8  Manufacturer Part Number: SD43-562MLB  [sd43]  (hidden comment: SD43)
L9  Manufacturer Part Number: SD43-102MLB  [sd43]  (hidden comment: SD43)
L10  Manufacturer Part Number: SD43-142MLB  [sd43]  (hidden comment: SD43)
L11  Impedance @ Frequency: 30 Ohm @ 100MHz  Current Rating: 6A  [R0805]  (hidden comment: 3.6uH, 12.5A)
Q2  FDS9926A  [SO8]
R25  35k7  [RESC1608X55N]
R26  28k7  [RESC1608X55N]
R27  0  [RESC1608X55N]
R28  0  [RESC1608X55N]
R29  0  [RESC1608X55N]
R30  5k49  [RESC1608X55N]
R31  31k6  [RESC1608X55N]
R32  240  [RESC1608X55N]
R39  0  [RESC1608X55N]
R40  0  [RESC1608X55N]
R41  35k7  [RESC1608X55N]
R42  16k9  [RESC1608X55N]
R43  0  [RESC1608X55N]
R98  0  [RESC1608X55N]
R99  0  [RESC1608X55N]
R100  8k66  [RESC1608X55N]
R101  16k2  [RESC1608X55N]
R102  64k9  [RESC1608X55N]
R103  0  [RESC1608X55N]
R104  4k42  [RESC1608X55N]
R105  22k  [RESC1608X55N]
R106  22k  [RESC1608X55N]
R107  41k2  [RESC1608X55N]
R108  13k3  [RESC1608X55N]
R109  0  [RESC1608X55N]
R110  3k24  [RESC1608X55N]
R112  4k7  [RESC1608X55N]
R113  4k7  [RESC1608X55N]
R114  4k7  [RESC1608X55N]
R115  4k7  [RESC1608X55N]
R?#1  10k  [RESC1608X55N]  (masked out: inside a compile mask, not in the netlist)
R?#2  150k  [RESC1608X55N]  (masked out: inside a compile mask, not in the netlist)
R?#3  200k  [RESC1608X55N]  (masked out: inside a compile mask, not in the netlist)
R?#4  25k5  [RESC1608X55N]  (masked out: inside a compile mask, not in the netlist)
R?#5  200k  [RESC1608X55N]  (masked out: inside a compile mask, not in the netlist)
R?#6  162k  [RESC2012X60N]  (masked out: inside a compile mask, not in the netlist)
R?#7  10k  [RESC1608X55N]  (masked out: inside a compile mask, not in the netlist)
R?#8  150k  [RESC1608X55N]  (masked out: inside a compile mask, not in the netlist)
R?#9  33k  [RESC1608X55N]  (masked out: inside a compile mask, not in the netlist)
R?#10  330  [RESC1608X55N]  (masked out: inside a compile mask, not in the netlist)
TP9  TP  [TP]  (value not drawn)  (no BOM)
TP10  TP  [TP]  (value not drawn)  (no BOM)
TP11  TP  [TP]  (value not drawn)  (no BOM)
TP12  TP  [TP]  (value not drawn)  (no BOM)
TP13  TP  [TP]  (value not drawn)  (no BOM)
TP14  TP  [TP]  (value not drawn)  (no BOM)
TP15  TP  [TP]  (value not drawn)  (no BOM)
U2  Manufacturer Part Number: LT3021ES8-1.2#TRPBF  [SO8]  (hidden comment: LT3021-1.2)
U3  ADP5052  [CP-48-13_M]  (parts A,B,C,D,E,F of 6)
U?#1  EN5364QI  [EN5364QI]  (masked out: inside a compile mask, not in the netlist)
U?#2  TPS82085SILT  [uSIP]  (masked out: inside a compile mask, not in the netlist)
U?#3  EN5364QI  [EN5364QI]  (masked out: inside a compile mask, not in the netlist)

### Blocks framed on the sheet
Vin to 1V2 @.7A: C34 TP9 U2
1V @6A: C?#1-C?#5 JM?#1 JM?#2 R?#1-R?#4 U?#1
1V8 @3A: C?#6-C?#11 R?#5 R?#6 U?#2
3V3 @6A: C?#12-C?#16 JM?#3 JM?#4 R?#7-R?#10 U?#3

### Nets
1V: C46.1 C187.2 L9.2 L11.1 R27.2 R101.1 TP13.1
1V2: C34.2 TP9.1 U2.2(OUT) U2.3(SENSE)
1V8: C29.1 C37.2 L1.2 R25.1 R43.1 R109.1 TP10.1
1V_MGT: L11.2 TP15.1
2V5: C41.1 C43.2 L8.2 R41.1 TP12.1
3V3: C190.1 C193.2 L10.2 R107.1 TP14.1
GND: C30.1 C31.1 C32.1 C33.1 C34.1 C35.1 C36.1 C37.1 C39.1 C42.1 C43.1 C103.1 C141.1 C187.1 C191.1 C193.1 D17.K R26.2 R29.2 R30.1 R31.2 R42.2 R98.1 R99.1 R100.1 R102.2 R104.1 R108.2 R110.1 R112.2 R113.2 R114.2 R115.2 U2.4(AGND) U2.6(PGND) U3.2(PGND3) U3.11(PGND4) U3.13(GND) U3.17(GND) U3.18(GND) U3.19(GND) U3.HTAB(EPAD)
Vin: C30.2 C31.2 C32.2 C33.2 C103.2 R103.2 U2.5(NC) U2.8(IN) U3.4(PVIN3) U3.8(PVIN5) U3.9(PVIN4) U3.24(PVIN2) U3.25(PVIN2) U3.35(PVIN1) U3.36(PVIN1)
VREG: C36.2 R28.1 R39.2 R40.2 TP11.1 U3.44(VREG)
NetC29_2: C29.2 R25.2 R26.1 U3.16(FB4)
NetC35_2: C35.2 R27.1 R112.1 U3.14(EN4)
NetC38_1: C38.1 U3.12(BST4)
NetC38_2: C38.2 L1.1 U3.10(SW4)
NetC39_2: C39.2 U3.42(VDD)
NetC40_1: C40.1 R30.2
NetC40_2: C40.2 U3.15(COMP4)
NetC41_2: C41.2 R41.2 R42.1 U3.45(FB3)
NetC42_2: C42.2 R43.2 R113.1 U3.48(EN3)
NetC44_1: C44.1 U3.1(BST3)
NetC44_2: C44.2 L8.1 U3.3(SW3)
NetC45_1: C45.1 R100.2
NetC45_2: C45.2 U3.46(COMP3)
NetC46_2: C46.2 R101.2 R102.1 U3.40(FB1)
NetC141_2: C141.2 R103.1 R114.1 U3.37(EN1)
NetC142_1: C142.1 U3.32(BST1)
NetC142_2: C142.2 L9.1 Q2.7(D2) Q2.8(D2) U3.33(SW1) U3.34(SW1)
NetC188_1: C188.1 R104.2
NetC188_2: C188.2 U3.39(COMP1)
NetC190_2: C190.2 R107.2 R108.1 U3.21(FB2)
NetC191_2: C191.2 R109.2 R115.1 U3.23(EN2)
NetC192_1: C192.1 U3.28(BST2)
NetC192_2: C192.2 L10.1 Q2.5(D1) Q2.6(D1) U3.26(SW2) U3.27(SW2)
NetC194_1: C194.1 R110.2
NetC194_2: C194.2 U3.22(COMP2)
NetD17_A: D17.A R32.1
NetQ2_1: Q2.1(S2) Q2.3(S1) R105.1 R106.1 U3.30(PGND)
NetQ2_2: Q2.2(G2) R105.2 U3.31(DL1)
NetQ2_4: Q2.4(G1) R106.2 U3.29(DL2)
NetR28_2: R28.2 R29.1 U3.43(SYNC/MODE)
NetR31_1: R31.1 U3.41(RT)
NetR32_2: R32.2 U3.20(PWRGD)
NetR39_1: R39.1 R98.2 U3.38(SS12)
NetR40_1: R40.1 R99.2 U3.47(SS34)

Not connected (* = marked no-connect by the designer): U3 5(EN5)* 6(FB5)* 7(VOUT5)*

### Notes on the sheet
- (near U3) 1V8
- (near R29) NOP
- (near U3) 2V5
- (near R98) NOP
- (near R99) NOP
- (near U3) 1V
- (near R105) Rlim1
- Rlim2
- (near U3) 3V3
- Title
- Size:
- Date:
- A3
- Number:
- Time:
- Revision:
- Sheet
- of
- File:
- (in symbol ADP5052ACPZ-R7, part A) INT VREG / 100mA              OSC
- (in symbol ADP5052ACPZ-R7, part B) CHANNEL 1 / BUCK REGULATOR / (1.2A/2.5A/4A)
- (in symbol ADP5052ACPZ-R7, part C) CHANNEL 2 / BUCK REGULATOR / (1.2A/2.5A/4A)
- (in symbol ADP5052ACPZ-R7, part D) CHANNEL 3 / BUCK REGULATOR / (1.2A)
- (in symbol ADP5052ACPZ-R7, part E) CHANNEL 4 / BUCK REGULATOR / (1.2A)
- (in symbol ADP5052ACPZ-R7, part F) CHANNEL 5 / 200mA LDO / REGULATOR
- (in symbol R0603_0R_JUMPER) 1%
- (in symbol R0603_3K24_0.1%_0.063W_10PPM) 0.1%
- (in symbol R0603_4K7_1%_0.1W_100PPM) 1%
- (in symbol R0603_4K42_0.1%_0.063W_10PPM) 0.1%
- (in symbol R0603_5K49_0.1%_0.063W_10PPM) 0.1%
- (in symbol R0603_8K66_0.1%_0.063W_10PPM) 0.1%
- (in symbol R0603_10K_0.1%_0.063W_10PPM) 0.1%
- (in symbol R0603_10k_0.1%_0.063W_10PPM) 0.1%
- (in symbol R0603_13K3_0.1%_0.063W_10PPM) 0.1%
- (in symbol R0603_16K2_0.1%_0.063W_10PPM) 0.1%
- (in symbol R0603_16K9_0.1%_0.063W_10PPM) 0.1%
- (in symbol R0603_22K_1%_0.1W_100PPM) 1%
- (in symbol R0603_25K5_0.1%_0.063W_10PPM) 0.1%
- (in symbol R0603_28K7_0.1%_0.063W_10PPM) 0.1%
- (in symbol R0603_31K6_0.1%_0.063W_10PPM) 0.1%
- (in symbol R0603_33K_1%_0.1W_100PPM) 1%
- (in symbol R0603_35K7_0.1%_0.063W_10PPM) 0.1%
- (in symbol R0603_41K2_0.1%_0.063W_10PPM) 0.1%
- (in symbol R0603_64K9_0.1%_0.063W_10PPM) 0.1%
- (in symbol R0603_150K_0.1%_0.063W_10PPM) 0.1%
- (in symbol R0603_200K_1%_0.1W_100PPM) 1%
- (in symbol R0603_240R_1%_0.1W_100PPM) 1%
- (in symbol R0603_330R_1%_0.1W_100PPM) 1%
- (in symbol R0805_162K_0.1%_0.125W_25PPM) 0.1%